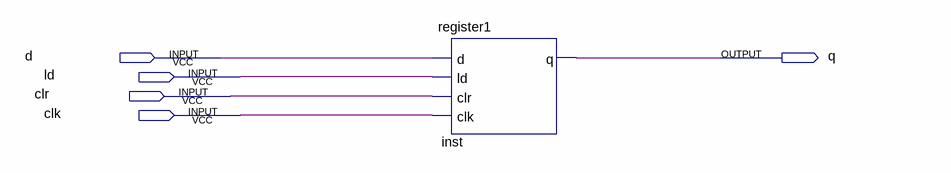
[diagram p0: schematic sheet]
// Quartus schematic q1_1.bdf as structural Verilog: 1 symbols, 5 pins
module q1_1 (
  input  d,
  input  ld,
  input  clr,
  input  clk,
  output q
);

  register1 inst (.d(d), .ld(ld), .clr(clr), .clk(clk), .q(q));
endmodule
